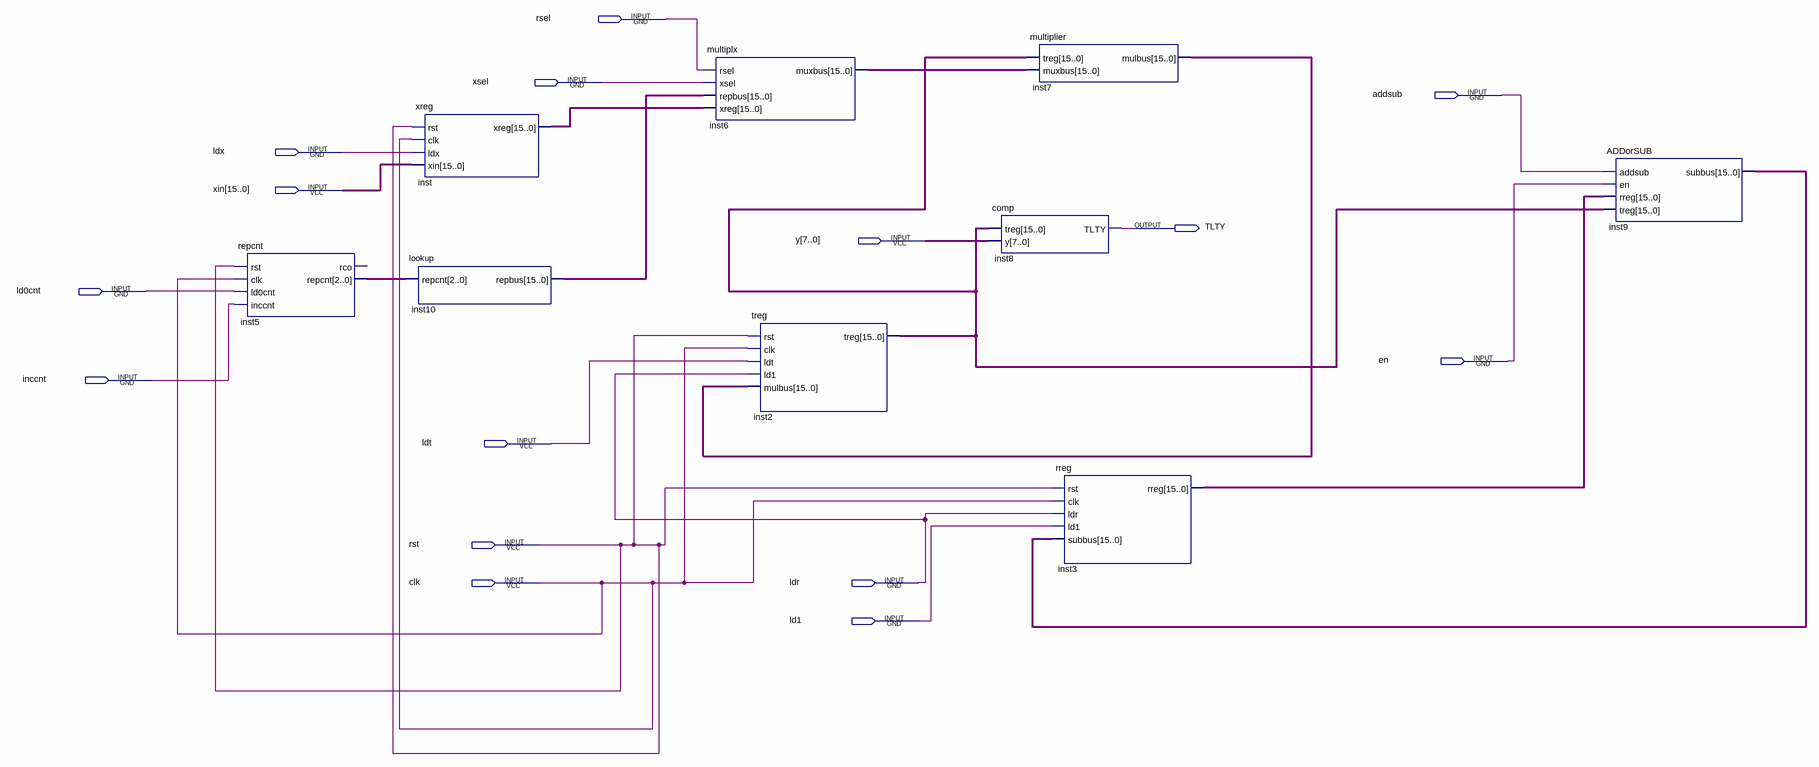
[diagram p0: schematic sheet]
// Quartus schematic ca6Q.bdf as structural Verilog: 9 symbols, 15 pins
module ca6Q (
  input  rsel,
  input  xsel,
  input  addsub,
  input  ldx,
  input  [15:0] xin,
  input  [7:0] y,
  input  ld0cnt,
  input  en,
  input  inccnt,
  input  ldt,
  input  rst,
  input  clk,
  input  ldr,
  input  ld1,
  output TLTY
);

  wire [2:0] inst5_repcnt;
  wire [15:0] inst2_treg, inst3_rreg, inst6_muxbus, inst7_mulbus, inst9_subbus, inst10_repbus, inst_xreg;

  repcnt inst5 (.rst(rst), .clk(clk), .ld0cnt(ld0cnt), .inccnt(inccnt), .repcnt(inst5_repcnt));  // open: rco
  xreg inst (.rst(rst), .clk(clk), .ldx(ldx), .xin(xin), .xreg(inst_xreg));
  lookup inst10 (.repcnt(inst5_repcnt), .repbus(inst10_repbus));
  multiplx inst6 (.rsel(rsel), .xsel(xsel), .repbus(inst10_repbus), .xreg(inst_xreg), .muxbus(inst6_muxbus));
  treg inst2 (.rst(rst), .clk(clk), .ldt(ldt), .ld1(ldr), .mulbus(inst7_mulbus), .treg(inst2_treg));
  comp inst8 (.treg(inst2_treg), .y(y), .TLTY(TLTY));
  multiplier inst7 (.treg(inst2_treg), .muxbus(inst6_muxbus), .mulbus(inst7_mulbus));
  rreg inst3 (.rst(rst), .clk(clk), .ldr(ldr), .ld1(ld1), .subbus(inst9_subbus), .rreg(inst3_rreg));
  ADDorSUB inst9 (.addsub(addsub), .en(en), .rreg(inst3_rreg), .treg(inst2_treg), .subbus(inst9_subbus));
endmodule
